# Altium project 油浴锅.PrjPcb
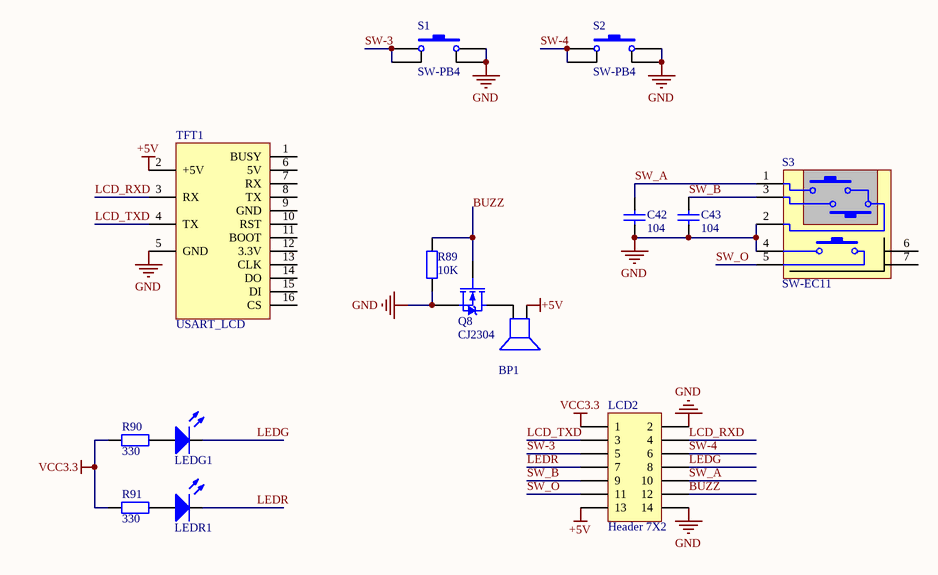
[diagram p0: 显示面板.SchDoc]
4 sheets, 243 parts. Net scope: global (net labels, ports and power ports of the same name join across sheets).
Board files: 显示面板.PcbDoc, 搅拌机主控.PcbDoc
Sheets:
  显示面板.SchDoc
  PT100检测电路.SchDoc
  MCU.SchDoc
  DC24V驱动.SchDoc

## Sheet 显示面板.SchDoc
size A4

### Parts
BP1  BUZZER  [蜂鸣器]  (value not drawn)
C42  value 104  [C-RAD-0603]  (hidden comment: Cap)
C43  value 104  [C-RAD-0603]  (hidden comment: Cap)
LCD2  Header 7X2  [HDR7X2_A1]
LEDG1  COLOUR  [LEDφ6]  (value not drawn)
LEDR1  COLOUR  [LEDφ6]  (value not drawn)
Q8  CJ2304  [SOT-23]
R89  value 10K  [0603-1]  (hidden comment: Res1)
R90  value 330  [0603-1]  (hidden comment: Res1)
R91  value 330  [0603-1]  (hidden comment: Res1)
S1  SW-PB4  [SW_PB4_A1]
S2  SW-PB4  [SW_PB4_A1]
S3  SW-EC11  [EC11]
TFT1  USART_LCD  [3.0寸]

### Nets
+5V: BP1.1(+) LCD2.13 TFT1.2(+5V)
GND: C42.1 C43.1 LCD2.2 LCD2.14 Q8.2(S) R89.1 S1.2 S1.3 S2.2 S2.3 S3.2 S3.4 TFT1.5(GND)
VCC3.3: LCD2.1 R90.2 R91.2
BUZZ: LCD2.12 Q8.1(G) R89.2
LCD_RXD: LCD2.4 TFT1.3(RX)
LCD_TXD: LCD2.3 TFT1.4(TX)
LEDG: LCD2.8 LEDG1.2(-)
LEDR: LCD2.7 LEDR1.2(-)
SW-3: LCD2.5 S1.1 S1.4
SW-4: LCD2.6 S2.1 S2.4
SW_A: C42.2 LCD2.10 S3.1
SW_B: C43.2 LCD2.9 S3.3
SW_O: LCD2.11 S3.5
NetBP1_2: BP1.2(-) Q8.3(D)
NetLEDG1_1: LEDG1.1(+) R90.1
NetLEDR1_1: LEDR1.1(+) R91.1

Not connected (* = marked no-connect by the designer): S3 6 7; TFT1 1(BUSY) 6(5V) 7(RX) 8(TX) 9(GND) 10(RST) 11(BOOT) 12(3.3V) 13(CLK) 14(DO) 15(DI) 16(CS)

### Library data of the parts
BP1 = BUZZER: 蜂鸣器
C42 C43 = Cap: 无极性电容; Published: 8-Jun-2000; LatestRevisionDate: 17-Jul-2002; LatestRevisionNote: Re-released for DXP Platform.; PackageReference: RAD-0.3; Publisher: Altium Limited
LCD2 = Header 7X2: Header, 7-Pin; LatestRevisionDate: 17-Jul-2002; LatestRevisionNote: Re-released for DXP Platform.; Publisher: Altium Limited
LEDG1 LEDR1 = ledφ6
Q8 = MOSFET-N: N-Channel MOSFET; PackageDocument: 1995/1996; Published: 8-Jun-2000; LatestRevisionDate: 17-Jul-2002; LatestRevisionNote: Re-released for DXP Platform.; PackageReference: E3; Publisher: Altium Limited
R89-R91 = Res1: 贴片电阻; Published: 8-Jun-2000; LatestRevisionDate: 17-Jul-2002; LatestRevisionNote: Re-released for DXP Platform.; PackageReference: AXIAL-0.4; Publisher: Altium Limited
S1 S2 = SW-PB4: 微动开关; Published: 24-Mar-1999; LatestRevisionDate: 17-Jul-2002; LatestRevisionNote: Re-released for DXP Platform.; PackageReference: SPST-2; Publisher: Altium Limited
S3 = SW-EC11: 旋转编码开关; Published: 24-Mar-1999; LatestRevisionDate: 17-Jul-2002; LatestRevisionNote: Re-released for DXP Platform.; PackageReference: SPST-2; Publisher: Altium Limited
TFT1 = USART_LCD: usart串口屏

## Sheet PT100检测电路.SchDoc
size A3
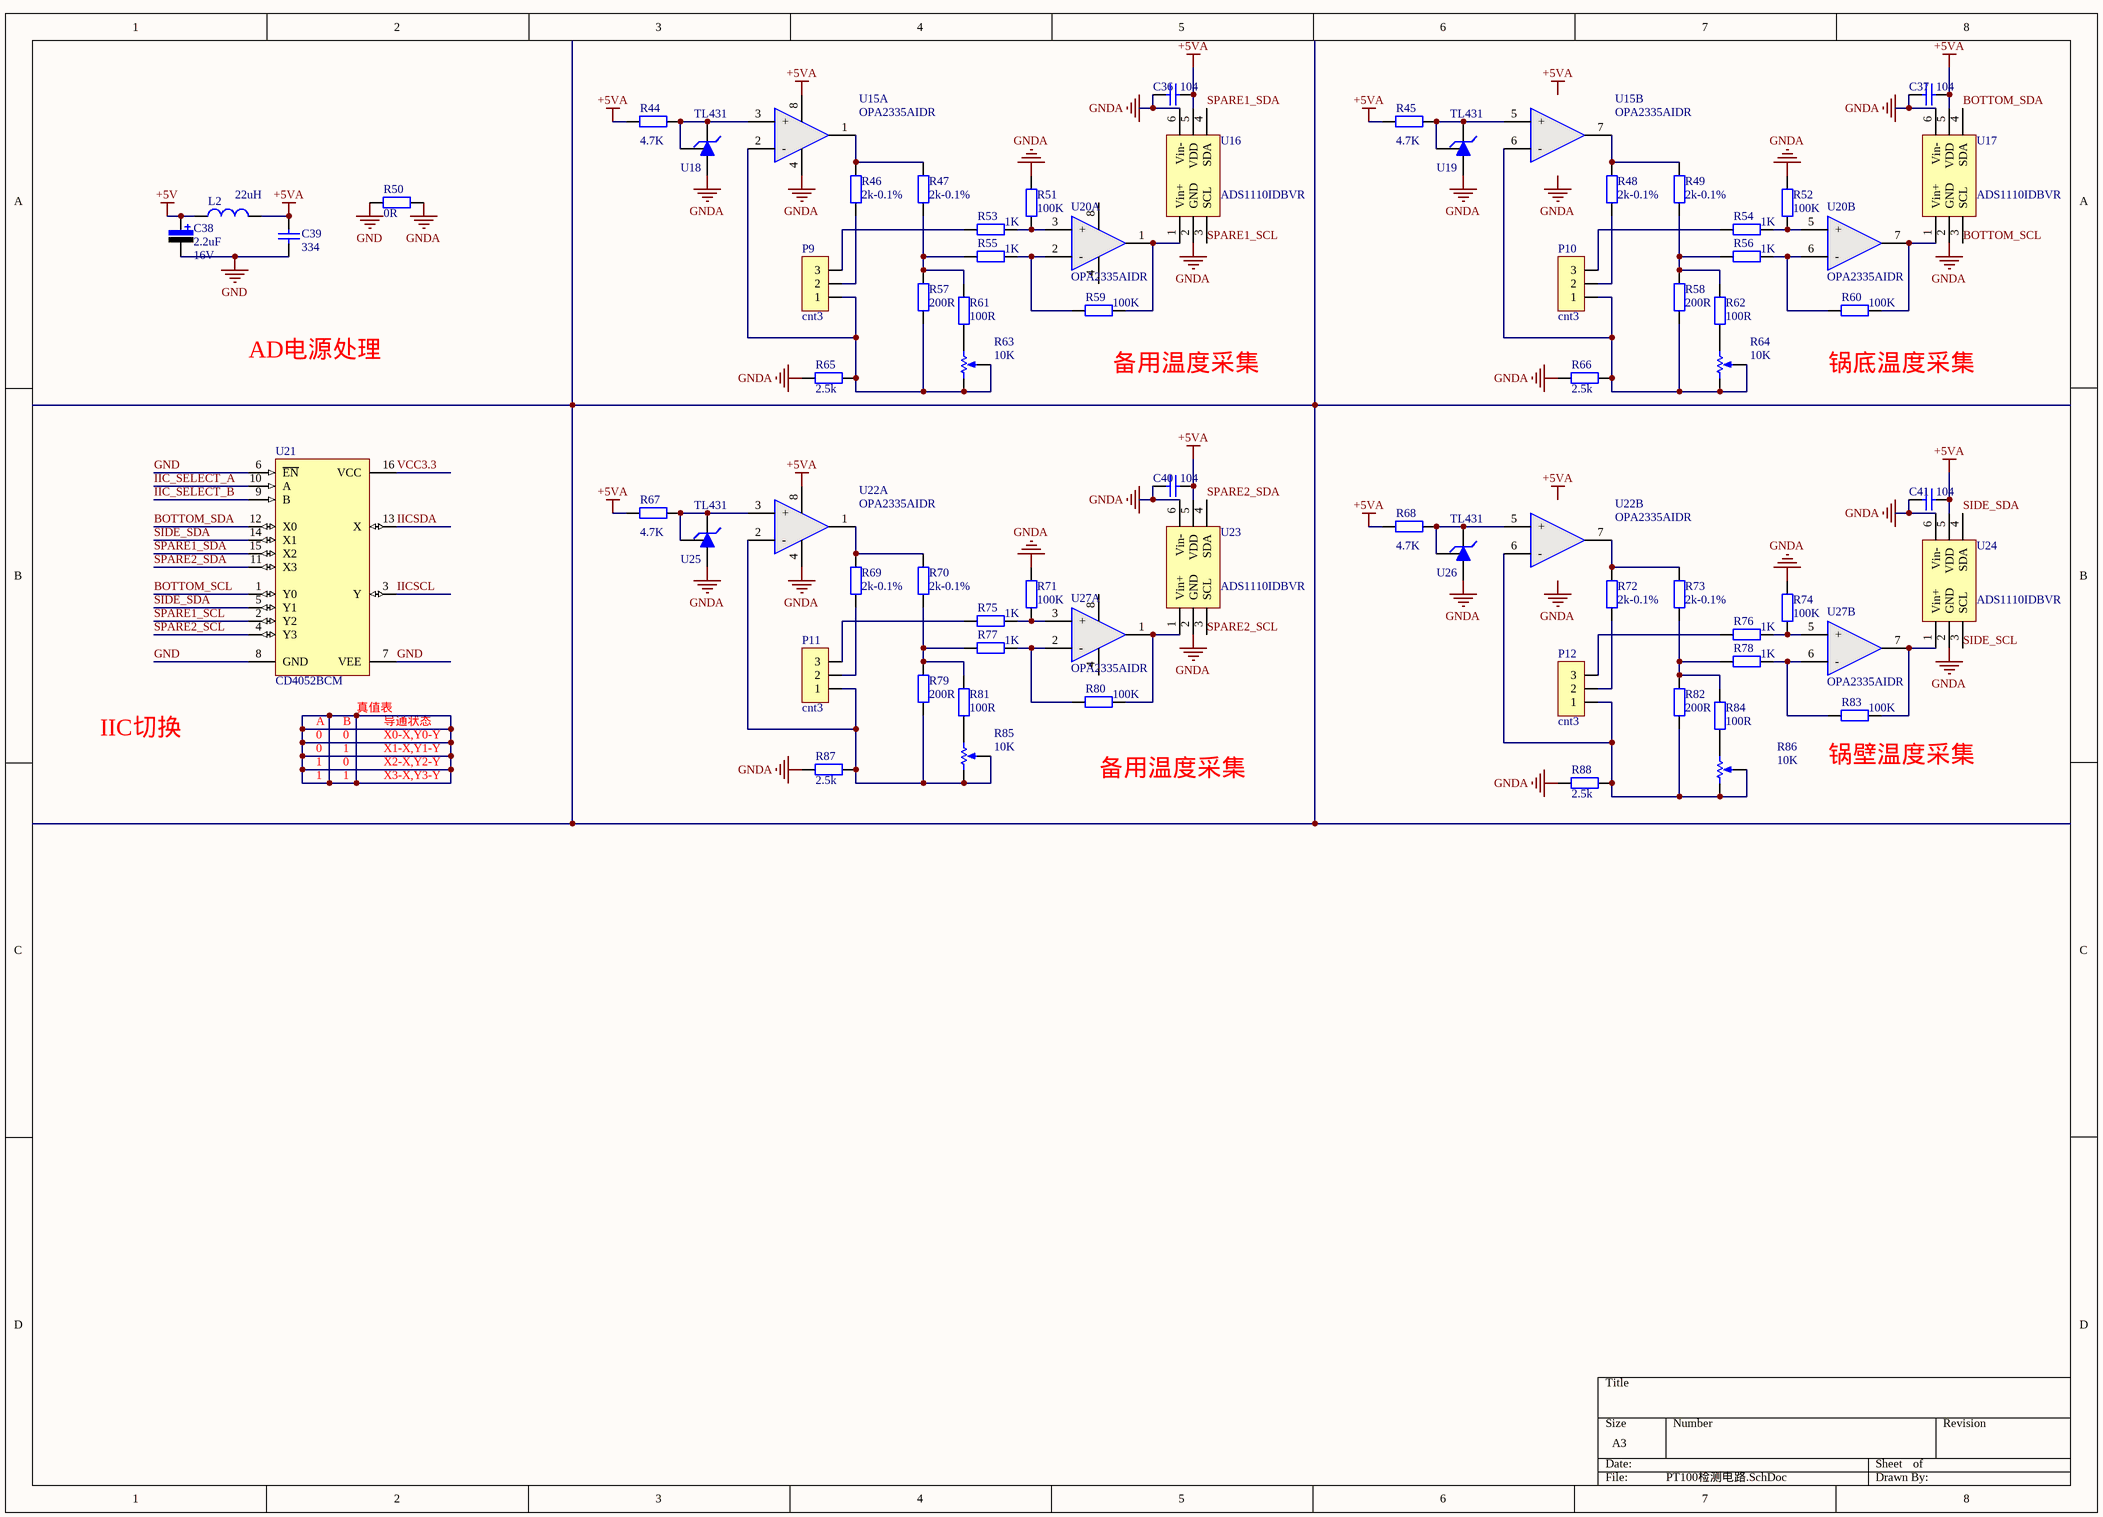
[diagram p1: PT100检测电路.SchDoc]

### Parts
C36  value 104  [C-RAD-0603]  (hidden comment: Cap)
C37  value 104  [C-RAD-0603]  (hidden comment: Cap)
C38  value 2.2uF  Vol: 16V  [CAP-3216]  (hidden comment: Cap Pol)
C39  value 334  [C-RAD-0603]  (hidden comment: Cap)
C40  value 104  [C-RAD-0603]  (hidden comment: Cap)
C41  value 104  [C-RAD-0603]  (hidden comment: Cap)
L2  value 22uH  [1206]  (hidden comment: Inductor)
P9  cnt3  [7.62mmPCB接线端子3p]
P10  cnt3  [7.62mmPCB接线端子3p]
P11  cnt3  [7.62mmPCB接线端子3p]
P12  cnt3  [7.62mmPCB接线端子3p]
R44  value 4.7K  [0603-1]  (hidden comment: Res1)
R45  value 4.7K  [0603-1]  (hidden comment: Res1)
R46  value 2k-0.1%  [0603-1]  (hidden comment: Res1)
R47  value 2k-0.1%  [0603-1]  (hidden comment: Res1)
R48  value 2k-0.1%  [0603-1]  (hidden comment: Res1)
R49  value 2k-0.1%  [0603-1]  (hidden comment: Res1)
R50  value 0R  [0603-1]  (hidden comment: Res1)
R51  value 100K  [0603-1]  (hidden comment: Res1)
R52  value 100K  [0603-1]  (hidden comment: Res1)
R53  value 1K  [0603-1]  (hidden comment: Res1)
R54  value 1K  [0603-1]  (hidden comment: Res1)
R55  value 1K  [0603-1]  (hidden comment: Res1)
R56  value 1K  [0603-1]  (hidden comment: Res1)
R57  value 200R  [0603-1]  (hidden comment: Res1)
R58  value 200R  [0603-1]  (hidden comment: Res1)
R59  value 100K  [0603-1]  (hidden comment: Res1)
R60  value 100K  [0603-1]  (hidden comment: Res1)
R61  value 100R  [0603-1]  (hidden comment: Res1)
R62  value 100R  [0603-1]  (hidden comment: Res1)
R63  value 10K  [VR-3266W]  (hidden comment: RPot)
R64  value 10K  [VR-3266W]  (hidden comment: RPot)
R65  value 2.5k  [0603-1]  (hidden comment: Res1)
R66  value 2.5k  [0603-1]  (hidden comment: Res1)
R67  value 4.7K  [0603-1]  (hidden comment: Res1)
R68  value 4.7K  [0603-1]  (hidden comment: Res1)
R69  value 2k-0.1%  [0603-1]  (hidden comment: Res1)
R70  value 2k-0.1%  [0603-1]  (hidden comment: Res1)
R71  value 100K  [0603-1]  (hidden comment: Res1)
R72  value 2k-0.1%  [0603-1]  (hidden comment: Res1)
R73  value 2k-0.1%  [0603-1]  (hidden comment: Res1)
R74  value 100K  [0603-1]  (hidden comment: Res1)
R75  value 1K  [0603-1]  (hidden comment: Res1)
R76  value 1K  [0603-1]  (hidden comment: Res1)
R77  value 1K  [0603-1]  (hidden comment: Res1)
R78  value 1K  [0603-1]  (hidden comment: Res1)
R79  value 200R  [0603-1]  (hidden comment: Res1)
R80  value 100K  [0603-1]  (hidden comment: Res1)
R81  value 100R  [0603-1]  (hidden comment: Res1)
R82  value 200R  [0603-1]  (hidden comment: Res1)
R83  value 100K  [0603-1]  (hidden comment: Res1)
R84  value 100R  [0603-1]  (hidden comment: Res1)
R85  value 10K  [VR-3266W]  (hidden comment: RPot)
R86  value 10K  [VR-3266W]  (hidden comment: RPot)
R87  value 2.5k  [0603-1]  (hidden comment: Res1)
R88  value 2.5k  [0603-1]  (hidden comment: Res1)
U15  OPA2335AIDR  [NSO8_N]  (parts A,B of 2)
U16  ADS1110IDBVR  [SOT23-6]
U17  ADS1110IDBVR  [SOT23-6]
U18  TL431  [SOT23]
U19  TL431  [SOT23]
U20  OPA2335AIDR  [NSO8_N]  (parts A,B of 2)
U21  CD4052BCM  [NSO16_M]
U22  OPA2335AIDR  [NSO8_N]  (parts A,B of 2)
U23  ADS1110IDBVR  [SOT23-6]
U24  ADS1110IDBVR  [SOT23-6]
U25  TL431  [SOT23]
U26  TL431  [SOT23]
U27  OPA2335AIDR  [NSO8_N]  (parts A,B of 2)

### Nets
+5V: C38.1 L2.1
+5VA: C36.2 C37.2 C39.1 C40.2 C41.2 L2.2 R44.1 R45.1 R67.1 R68.1 U15.8(V+) U16.5(VDD) U17.5(VDD) U22.8(V+) U23.5(VDD) U24.5(VDD)
GND: C38.2 C39.2 R50.2 U21.6(~{EN}) U21.7(VEE) U21.8(GND)
GNDA: C36.1 C37.1 C40.1 C41.1 R50.1 R51.2 R52.2 R65.1 R66.1 R71.2 R74.2 R87.1 R88.1 U15.4(V-) U16.2(GND) U16.6(Vin-) U17.2(GND) U17.6(Vin-) U18.3 U19.3 U22.4(V-) U23.2(GND) U23.6(Vin-) U24.2(GND) U24.6(Vin-) U25.3 U26.3
VCC3.3: U21.16(VCC)
BOTTOM_SCL: U17.3(SCL) U21.1(Y0)
BOTTOM_SDA: U17.4(SDA) U21.12(X0)
IIC_SELECT_A: U21.10(A)
IIC_SELECT_B: U21.9(B)
IICSCL: U21.3(Y)
IICSDA: U21.13(X)
SIDE_SCL: U24.3(SCL)
SIDE_SDA: U21.5(Y1) U21.14(X1) U24.4(SDA)
SPARE1_SCL: U16.3(SCL) U21.2(Y2)
SPARE1_SDA: U16.4(SDA) U21.15(X2)
SPARE2_SCL: U21.4(Y3) U23.3(SCL)
SPARE2_SDA: U21.11(X3) U23.4(SDA)
NetP9_1: P9.1 R57.1 R63.1(TOP) R63.2(TAP) R65.2 U15.2(-)
NetP9_2: P9.2 R46.1
NetP9_3: P9.3 R53.1
NetP10_1: P10.1 R58.1 R64.1(TOP) R64.2(TAP) R66.2 U15.6(-)
NetP10_2: P10.2 R48.1
NetP10_3: P10.3 R54.1
NetP11_1: P11.1 R79.1 R85.1(TOP) R85.2(TAP) R87.2 U22.2(-)
NetP11_2: P11.2 R69.1
NetP11_3: P11.3 R75.1
NetP12_1: P12.1 R82.1 R86.1(TOP) R86.2(TAP) R88.2 U22.6(-)
NetP12_2: P12.2 R72.1
NetP12_3: P12.3 R76.1
NetR44_2: R44.2 U15.3(+) U18.1 U18.2
NetR45_2: R45.2 U15.5(+) U19.1 U19.2
NetR46_2: R46.2 R47.2 U15.1(OUT1)
NetR47_1: R47.1 R55.1 R57.2 R61.2
NetR48_2: R48.2 R49.2 U15.7(OUT2)
NetR49_1: R49.1 R56.1 R58.2 R62.2
NetR51_1: R51.1 R53.2 U20.3(+)
NetR52_1: R52.1 R54.2 U20.5(+)
NetR55_2: R55.2 R59.1 U20.2(-)
NetR56_2: R56.2 R60.1 U20.6(-)
NetR59_2: R59.2 U16.1(Vin+) U20.1(OUT1)
NetR60_2: R60.2 U17.1(Vin+) U20.7(OUT2)
NetR61_1: R61.1 R63.3(BOT)
NetR62_1: R62.1 R64.3(BOT)
NetR67_2: R67.2 U22.3(+) U25.1 U25.2
NetR68_2: R68.2 U22.5(+) U26.1 U26.2
NetR69_2: R69.2 R70.2 U22.1(OUT1)
NetR70_1: R70.1 R77.1 R79.2 R81.2
NetR71_1: R71.1 R75.2 U27.3(+)
NetR72_2: R72.2 R73.2 U22.7(OUT2)
NetR73_1: R73.1 R78.1 R82.2 R84.2
NetR74_1: R74.1 R76.2 U27.5(+)
NetR77_2: R77.2 R80.1 U27.2(-)
NetR78_2: R78.2 R83.1 U27.6(-)
NetR80_2: R80.2 U23.1(Vin+) U27.1(OUT1)
NetR81_1: R81.1 R85.3(BOT)
NetR83_2: R83.2 U24.1(Vin+) U27.7(OUT2)
NetR84_1: R84.1 R86.3(BOT)

Not connected (* = marked no-connect by the designer): U20 4(V-) 8(V+); U27 4(V-) 8(V+)

### Notes on the sheet
- AD电源处理
- (near R59) 备用温度采集
- (near R60) 锅底温度采集
- A
- B
- (near U21) 真值表
- 导通状态
- IIC切换
- 0
- 1
- X0-X,Y0-Y
- X1-X,Y1-Y
- X2-X,Y2-Y
- X3-X,Y3-Y
- 备用温度采集
- (near R83) 锅壁温度采集
- Labels drawn without touching a wire or pin: +5VA, GNDA

### Library data of the parts
C36 C37 C39-C41 = Cap: 无极性电容; Published: 8-Jun-2000; LatestRevisionDate: 17-Jul-2002; LatestRevisionNote: Re-released for DXP Platform.; PackageReference: RAD-0.3; Publisher: Altium Limited
C38 = Cap Pol: 极性电解电容; Published: 8-Jun-2000; LatestRevisionDate: 17-Jul-2002; LatestRevisionNote: Re-released for DXP Platform.; PackageReference: RB7.6-15; Publisher: Altium Limited
L2 = Inductor: 电感; Code_IEC: 1005; Published: 8-Jun-2000; LatestRevisionDate: 17-Jul-2002; LatestRevisionNote: Re-released for DXP Platform.; PackageReference: 0402-A; Publisher: Altium Limited; Code_JEITA: 0402
P9-P12 = cnt3: 3p接线端子
R44-R62 R65-R84 R87 R88 = Res1: 贴片电阻; Published: 8-Jun-2000; LatestRevisionDate: 17-Jul-2002; LatestRevisionNote: Re-released for DXP Platform.; PackageReference: AXIAL-0.4; Publisher: Altium Limited
R63 R64 R85 R86 = RPot: 精密可调电阻; Sim Note: Enter the Resistance value and the set point into parameter fields.; Set Position: 0.5; Published: 8-Jun-2000; LatestRevisionDate: 17-Jul-2002; LatestRevisionNote: Re-released for DXP Platform.; PackageReference: VR5; Publisher: Altium Limited
U15 U20 U22 U27 = AD8667: 双运放
U16 U17 U23 U24 = ADS1110IDBVR: 16位内部基准AD芯片IIC
U21 = CD4052BCM: 双通道模拟开关; Published: 17-Jul-2002; LatestRevisionDate: 13-Apr-2006; LatestRevisionNote: IPC-7351 Footprint Added.; DatasheetVersion: Jan-1999; PackageVersion: 2000; PackageReference: M16A; Publisher: Altium Limited; PackageDescription: 16-Pin Small Outline Integrated Circuit 1.27 mm Pitch; Code_IPC: SOIC127P600-16; ComponentLink1Description: Manufacturer Link; ComponentLink1URL: http://www.fairchildsemi.com/; ComponentLink2Description: Datasheet; ComponentLink2URL: http://www.fairchildsemi.com/ds/CD%2FCD4052BC.pdf

## Sheet MCU.SchDoc
size A3
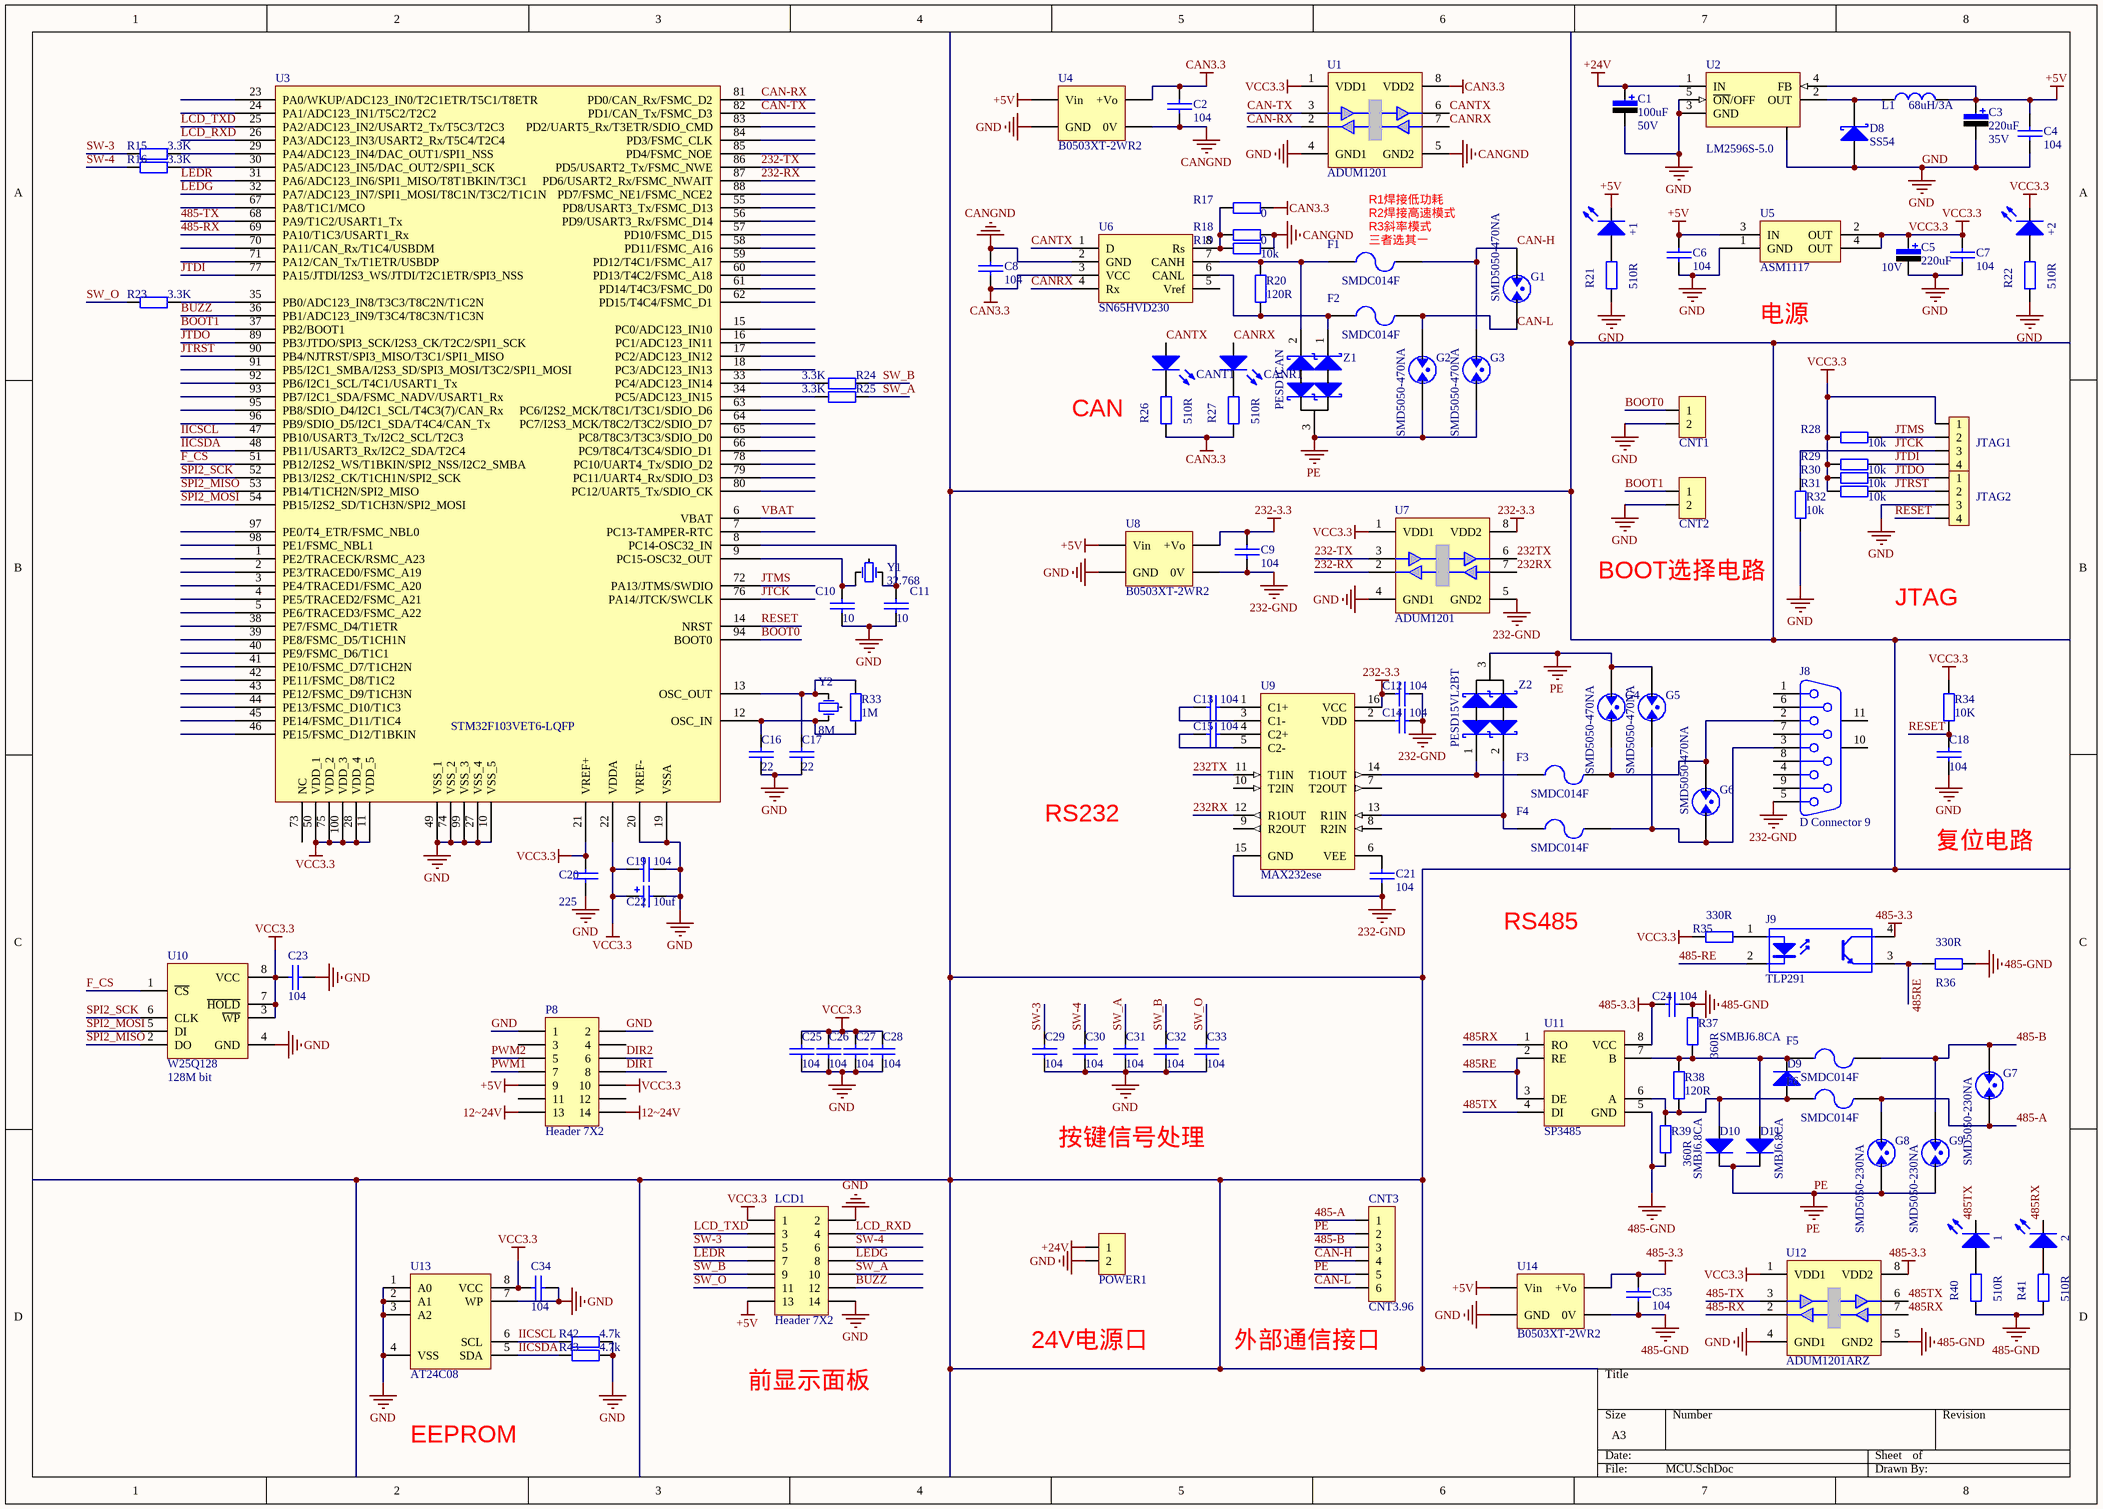
[diagram p2: MCU.SchDoc]

### Parts
1  COLOUR  [0603LED]  (value not drawn)
2  COLOUR  [0603LED]  (value not drawn)
+1  COLOUR  [0603LED]  (value not drawn)
+2  COLOUR  [0603LED]  (value not drawn)
C1  value 100uF  Vol: 50V  [C-RB-S10]  (hidden comment: Cap Pol)
C2  104  [0603C]
C3  value 220uF  Vol: 35V  [C-RB-S10]  (hidden comment: Cap Pol)
C4  104  [0603C]
C5  value 220uF  Vol: 10V  [CAP-7343]  (hidden comment: Cap Pol)
C6  104  [0603C]
C7  104  [0603C]
C8  104  [0603C]
C9  104  [0603C]
C10  10  [0603C]
C11  10  [0603C]
C12  104  [0603C]
C13  104  [0603C]
C14  104  [0603C]
C15  104  [0603C]
C16  22  [0603C]
C17  22  [0603C]
C18  104  [0603C]
C19  104  [0603C]
C20  225  [0603C]
C21  104  [0603C]
C22  10uf  [ct3216-18]
C23  104  [0603C]
C24  104  [0603C]
C25  104  [0603C]
C26  104  [0603C]
C27  104  [0603C]
C28  104  [0603C]
C29  104  [0603C]
C30  104  [0603C]
C31  104  [0603C]
C32  104  [0603C]
C33  104  [0603C]
C34  104  [0603C]
C35  104  [0603C]
CANR1  COLOUR  [0603LED]  (value not drawn)
CANT1  COLOUR  [0603LED]  (value not drawn)
CNT1  cnt2p  [cont-1]  (value not drawn)
CNT2  cnt2p  [cont-1]  (value not drawn)
CNT3  CNT3.96  [CNT3.96]
D8  Type: SS54  [DIODE-SMA]  (hidden comment: D-Schottky)
D9  Type: SMBJ6.8CA  [DIODE-SMB]  (hidden comment: TVS)
D10  Type: SMBJ6.8CA  [DIODE-SMB]  (hidden comment: TVS)
D11  Type: SMBJ6.8CA  [DIODE-SMB]  (hidden comment: TVS)
F1  SMDC014F  [1812]
F2  value SMDC014F  [1812]  (hidden comment: Fuse)
F3  SMDC014F  [1812]
F4  value SMDC014F  [1812]  (hidden comment: Fuse)
F5  SMDC014F  [1812]
F6  value SMDC014F  [1812]  (hidden comment: Fuse)
G1  SMD5050-470NA  [SMD5050]
G2  SMD5050-470NA  [SMD5050]
G3  SMD5050-470NA  [SMD5050]
G4  SMD5050-470NA  [SMD5050]
G5  SMD5050-470NA  [SMD5050]
G6  SMD5050-470NA  [SMD5050]
G7  SMD5050-230NA  [SMD5050]
G8  SMD5050-230NA  [SMD5050]
G9  SMD5050-230NA  [SMD5050]
J8  D Connector 9  [DB9-M]
J9  TLP291  [SOP127P710X350-4N]
JTAG1  单排插针11mm4p  [单排插针2.54]  (value not drawn)
JTAG2  单排插针11mm4p  [单排插针2.54]  (value not drawn)
L1  value 68uH/3A  [L-SMD-12]  (hidden comment: Inductor)
LCD1  Header 7X2  [HDR7X2_A1]
P8  Header 7X2  [HDR7X2_A1]
POWER1  CNT5.08MM*2 WAN  [CNT5.08*2WAN]  (value not drawn)
R15  value 3.3K  [0603-1]  (hidden comment: Res1)
R16  value 3.3K  [0603-1]  (hidden comment: Res1)
R17  value 0  [0603-1]  (hidden comment: Res1)
R18  value 0  [0603-1]  (hidden comment: Res1)
R19  value 10k  [0603-1]  (hidden comment: Res1)
R20  value 120R  [0603-1]  (hidden comment: Res1)
R21  value 510R  [0603-1]  (hidden comment: Res1)
R22  value 510R  [0603-1]  (hidden comment: Res1)
R23  value 3.3K  [0603-1]  (hidden comment: Res1)
R24  value 3.3K  [0603-1]  (hidden comment: Res1)
R25  value 3.3K  [0603-1]  (hidden comment: Res1)
R26  value 510R  [0603-1]  (hidden comment: Res1)
R27  value 510R  [0603-1]  (hidden comment: Res1)
R28  value 10k  [0603-1]  (hidden comment: Res1)
R29  value 10k  [0603-1]  (hidden comment: Res1)
R30  value 10k  [0603-1]  (hidden comment: Res1)
R31  value 10k  [0603-1]  (hidden comment: Res1)
R32  value 10k  [0603-1]  (hidden comment: Res1)
R33  value 1M  [0603-1]  (hidden comment: Res1)
R34  value 10K  [0603-1]  (hidden comment: Res1)
R35  value 330R  [0603-1]  (hidden comment: Res1)
R36  value 330R  [0603-1]  (hidden comment: Res1)
R37  value 360R  [0603-1]  (hidden comment: Res1)
R38  value 120R  [0603-1]  (hidden comment: Res1)
R39  value 360R  [0603-1]  (hidden comment: Res1)
R40  value 510R  [0603-1]  (hidden comment: Res1)
R41  value 510R  [0603-1]  (hidden comment: Res1)
R42  value 4.7k  [0603-1]  (hidden comment: Res1)
R43  value 4.7k  [0603-1]  (hidden comment: Res1)
U1  ADUM1201  [NSO8_N]
U2  LM2596S-5.0  [TO-263-5]
U3  STM32F103VET6-LQFP  [LQFP-100_M]
U4  B0503XT-2WR2  [B_XT-2WR2]
U5  ASM1117  [SOT-223]
U6  SN65HVD230  [NSO8_N]
U7  ADUM1201  [NSO8_N]
U8  B0503XT-2WR2  [B_XT-2WR2]
U9  MAX232ese  [NSO16_M]
U10  W25Q128  Memory: 128M bit  [SOIC8_W]
U11  SP3485  [NSO8_N]
U12  ADUM1201ARZ  [NSO8_N]
U13  AT24C08  [SOIC8_N]
U14  B0503XT-2WR2  [B_XT-2WR2]
Y1  value 32.768  [MC-146]  (hidden comment: XTAL_SM)
Y2  value 8M  [xtal3225]  (hidden comment: XTAL_SM)
Z1  PESD1CAN  [SOT-23]
Z2  PESD15VL2BT  [SOT-23]

### Nets
12~24V: P8.13 P8.14
232-3.3: C9.1 C12.2 U7.8(VDD2) U8.9(+Vo) U9.16(VCC)
232-GND: C9.2 C12.1 C14.1 C21.1 J8.5 U7.5(GND2) U8.8(0V) U9.15(GND)
485-3.3: C24.2 C35.1 J9.4(C) U11.8(VCC) U12.8(VDD2) U14.9(+Vo)
485-GND: C24.1 C35.2 R36.1 R37.2 R39.1 R40.1 R41.1 U11.5(GND) U12.5(GND2) U14.8(0V)
+5V: +1.2(-) C3.1 C4.1 C6.1 L1.2 LCD1.13 P8.9 U2.4(FB) U4.14(Vin) U5.3(IN) U8.14(Vin) U14.14(Vin)
+24V: C1.1 POWER1.1 U2.1(IN)
CAN3.3: C2.1 C8.2 R17.1 R26.1 R27.1 U1.8(VDD2) U4.9(+Vo) U6.3(VCC)
CANGND: C2.2 C8.1 R18.1 R19.1 U1.5(GND2) U4.8(0V) U6.2(GND)
GND: C1.2 C3.2 C4.2 C5.2 C6.2 C7.2 C10.2 C11.2 C16.2 C17.2 C18.1 C19.1 C20.1 C22.2 C23.1 C25.1 C26.1 C27.1 C28.1 C29.2 C30.2 C31.2 C32.2 C33.2 C34.1 CNT1.2 CNT2.2 D8.1(A) JTAG2.3 LCD1.2 LCD1.14 P8.1 P8.2 POWER1.2 R21.1 R22.1 R32.2 R42.1 R43.1 U1.4(GND1) U2.3(GND) U2.5(~{ON}/OFF) U2.6 U3.10(VSS_5) U3.19(VSSA) U3.20(VREF-) U3.27(VSS_4) U3.49(VSS_1) U3.74(VSS_2) U3.99(VSS_3) U4.1(GND) U5.1(GND) U7.4(GND1) U8.1(GND) U10.4(GND) U12.4(GND1) U13.1(A0) U13.2(A1) U13.3(A2) U13.4(VSS) U13.7(WP) U14.1(GND)
PE: CNT3.2 CNT3.5 D10.2(K) D11.2(K) G2.2 G3.2 G4.1 G5.1 G8.2 G9.2 Z1.3 Z2.3
VCC3.3: +2.2(-) C5.1 C7.1 C19.2 C20.2 C22.1 C23.2 C25.2 C26.2 C27.2 C28.2 C34.2 JTAG1.1 LCD1.1 P8.10 R28.2 R29.2 R30.2 R31.2 R34.2 R35.2 U1.1(VDD1) U3.11(VDD_5) U3.21(VREF+) U3.22(VDDA) U3.28(VDD_4) U3.50(VDD_1) U3.75(VDD_2) U3.100(VDD_3) U5.2(OUT) U5.4(OUT) U7.1(VDD1) U10.3(~{WP}) U10.7(~{HOLD}) U10.8(VCC) U12.1(VDD1) U13.8(VCC)
232-RX: U3.87(PD6/USART2_Rx/FSMC_NWAIT) U7.2(Voa)
232-TX: U3.86(PD5/USART2_Tx/FSMC_NWE) U7.3(Vib)
232RX: U7.7(Via) U9.12(R1OUT)
232TX: U7.6(Vob) U9.11(T1IN)
485-A: CNT3.1 F6.2 G7.2 G8.1
485-B: CNT3.3 F5.2 G7.1 G9.1
485-RE: J9.2(K)
485-RX: U3.69(PA10/T1C3/USART1_Rx) U12.2(Voa)
485-TX: U3.68(PA9/T1C2/USART1_Tx) U12.3(Vib)
485RE: J9.3(E) R36.2 U11.2(RE) U11.3(DE)
485RX: 2.2(-) U11.1(RO) U12.7(Via)
485TX: 1.2(-) U11.4(DI) U12.6(Vob)
BOOT0: CNT1.1 U3.94(BOOT0)
BOOT1: CNT2.1 U3.37(PB2/BOOT1)
BUZZ: LCD1.12 U3.36(PB1/ADC123_IN9/T3C4/T8C3N/T1C3N)
CAN-H: CNT3.4 F1.2 G1.1 G3.1
CAN-L: CNT3.6 F2.2 G1.2 G2.1
CAN-RX: U1.2(Voa) U3.81(PD0/CAN_Rx/FSMC_D2)
CAN-TX: U1.3(Vib) U3.82(PD1/CAN_Tx/FSMC_D3)
CANRX: CANR1.1(+) U1.7(Via) U6.4(Rx)
CANTX: CANT1.1(+) U1.6(Vob) U6.1(D)
DIR1: P8.8
DIR2: P8.6
F_CS: U3.51(PB12/I2S2_WS/T1BKIN/SPI2_NSS/I2C2_SMBA) U10.1(~{CS})
IICSCL: R42.2 U3.47(PB10/USART3_Tx/I2C2_SCL/T2C3) U13.6(SCL)
IICSDA: R43.2 U3.48(PB11/USART3_Rx/I2C2_SDA/T2C4) U13.5(SDA)
JTCK: JTAG1.3 R32.1 U3.76(PA14/JTCK/SWCLK)
JTDI: JTAG1.4 R29.1 U3.77(PA15/JTDI/I2S3_WS/JTDI/T2C1ETR/SPI3_NSS)
JTDO: JTAG2.1 R30.1 U3.89(PB3/JTDO/SPI3_SCK/I2S3_CK/T2C2/SPI1_SCK)
JTMS: JTAG1.2 R28.1 U3.72(PA13/JTMS/SWDIO)
JTRST: JTAG2.2 R31.1 U3.90(PB4/NJTRST/SPI3_MISO/T3C1/SPI1_MISO)
LCD_RXD: LCD1.4 U3.26(PA3/ADC123_IN3/USART2_Rx/T5C4/T2C4)
LCD_TXD: LCD1.3 U3.25(PA2/ADC123_IN2/USART2_Tx/T5C3/T2C3)
LEDG: LCD1.8 U3.32(PA7/ADC123_IN7/SPI1_MOSI/T8C1N/T3C2/T1C1N)
LEDR: LCD1.7 U3.31(PA6/ADC123_IN6/SPI1_MISO/T8T1BKIN/T3C1)
PWM1: P8.7
PWM2: P8.5
RESET: C18.2 JTAG2.4 R34.1 U3.14(NRST)
SPI2_MISO: U3.53(PB14/T1CH2N/SPI2_MISO) U10.2(DO)
SPI2_MOSI: U3.54(PB15/I2S2_SD/T1CH3N/SPI2_MOSI) U10.5(DI)
SPI2_SCK: U3.52(PB13/I2S2_CK/T1CH1N/SPI2_SCK) U10.6(CLK)
SW-3: C29.1 LCD1.5 R15.2
SW-4: C30.1 LCD1.6 R16.2
SW_A: C31.1 LCD1.10 R25.2
SW_B: C32.1 LCD1.9 R24.2
SW_O: C33.1 LCD1.11 R23.2
VBAT: U3.6(VBAT)
Net1_1: 1.1(+) R40.2
Net2_1: 2.1(+) R41.2
Net+1_1: +1.1(+) R21.2
Net+2_1: +2.1(+) R22.2
NetC10_1: C10.1 U3.9(PC15-OSC32_OUT) Y1.1(OSC1)
NetC11_1: C11.1 U3.8(PC14-OSC32_IN) Y1.2(OSC2)
NetC13_1: C13.1 U9.1(C1+)
NetC13_2: C13.2 U9.3(C1-)
NetC14_2: C14.2 U9.2(VDD)
NetC15_1: C15.1 U9.4(C2+)
NetC15_2: C15.2 U9.5(C2-)
NetC16_1: C16.1 R33.1 U3.12(OSC_IN) Y2.1(OSC1)
NetC17_1: C17.1 R33.2 U3.13(OSC_OUT) Y2.2(OSC2)
NetC21_2: C21.2 U9.6(VEE)
NetCANR1_2: CANR1.2(-) R27.2
NetCANT1_2: CANT1.2(-) R26.2
NetD8_2: D8.2(K) L1.1 U2.2(OUT)
NetD9_1: D9.1(A) D10.1(A) F6.1 R38.1 R39.2 U11.6(A)
NetD9_2: D9.2(K) D11.1(A) F5.1 R37.1 R38.2 U11.7(B)
NetF1_1: F1.1 R20.2 U6.7(CANH) Z1.2
NetF2_1: F2.1 R20.1 U6.6(CANL) Z1.1
NetF3_1: F3.1 U9.14(T1OUT) Z2.1
NetF3_2: F3.2 G4.2 G6.1 J8.2
NetF4_1: F4.1 U9.13(R1IN) Z2.2
NetF4_2: F4.2 G5.2 G6.2 J8.3
NetJ9_1: J9.1(A) R35.1
NetR15_1: R15.1 U3.29(PA4/ADC123_IN4/DAC_OUT1/SPI1_NSS)
NetR16_1: R16.1 U3.30(PA5/ADC123_IN5/DAC_OUT2/SPI1_SCK)
NetR17_2: R17.2 R18.2 R19.2 U6.8(Rs)
NetR23_1: R23.1 U3.35(PB0/ADC123_IN8/T3C3/T8C2N/T1C2N)
NetR24_1: R24.1 U3.33(PC4/ADC123_IN14)
NetR25_1: R25.1 U3.34(PC5/ADC123_IN15)

Not connected (* = marked no-connect by the designer): J8 1 4 6 7 8 9 10(MH1) 11(MH2); P8 3 4 11 12; U3 1(PE2/TRACECK/RSMC_A23) 2(PE3/TRACED0/FSMC_A19) 3(PE4/TRACED1/FSMC_A20) 4(PE5/TRACED2/FSMC_A21) 5(PE6/TRACED3/FSMC_A22) 7(PC13-TAMPER-RTC) 15(PC0/ADC123_IN10) 16(PC1/ADC123_IN11) 17(PC2/ADC123_IN12) 18(PC3/ADC123_IN13) 23(PA0/WKUP/ADC123_IN0/T2C1ETR/T5C1/T8ETR) 24(PA1/ADC123_IN1/T5C2/T2C2) 38(PE7/FSMC_D4/T1ETR) 39(PE8/FSMC_D5/T1CH1N) 40(PE9/FSMC_D6/T1C1) 41(PE10/FSMC_D7/T1CH2N) 42(PE11/FSMC_D8/T1C2) 43(PE12/FSMC_D9/T1CH3N) 44(PE13/FSMC_D10/T1C3) 45(PE14/FSMC_D11/T1C4) 46(PE15/FSMC_D12/T1BKIN) 55(PD8/USART3_Tx/FSMC_D13) 56(PD9/USART3_Rx/FSMC_D14) 57(PD10/FSMC_D15) 58(PD11/FSMC_A16) 59(PD12/T4C1/FSMC_A17) 60(PD13/T4C2/FSMC_A18) 61(PD14/T4C3/FSMC_D0) 62(PD15/T4C4/FSMC_D1) 63(PC6/I2S2_MCK/T8C1/T3C1/SDIO_D6) 64(PC7/I2S3_MCK/T8C2/T3C2/SDIO_D7) 65(PC8/T8C3/T3C3/SDIO_D0) 66(PC9/T8C4/T3C4/SDIO_D1) 67(PA8/T1C1/MCO) 70(PA11/CAN_Rx/T1C4/USBDM) 71(PA12/CAN_Tx/T1ETR/USBDP) 73(NC) 78(PC10/UART4_Tx/SDIO_D2) 79(PC11/UART4_Rx/SDIO_D3) 80(PC12/UART5_Tx/SDIO_CK) 83(PD2/UART5_Rx/T3ETR/SDIO_CMD) 84(PD3/FSMC_CLK) 85(PD4/FSMC_NOE) 88(PD7/FSMC_NE1/FSMC_NCE2) 91(PB5/I2C1_SMBA/I2S3_SD/SPI3_MOSI/T3C2/SPI1_MOSI) 92(PB6/I2C1_SCL/T4C1/USART1_Tx) 93(PB7/I2C1_SDA/FSMC_NADV/USART1_Rx) 95(PB8/SDIO_D4/I2C1_SCL/T4C3(7)/CAN_Rx) 96(PB9/SDIO_D5/I2C1_SDA/T4C4/CAN_Tx) 97(PE0/T4_ETR/FSMC_NBL0) 98(PE1/FSMC_NBL1); U6 5(Vref); U9 7(T2OUT) 8(R2IN) 9(R2OUT) 10(T2IN); Y1 3; Y2 3

### Notes on the sheet
- R1焊接低功耗
- R2焊接高速模式
- (near F1) R3斜率模式
- (near F1) 三者选其一
- 电源
- CAN
- BOOT选择电路
- JTAG
- RS232
- 复位电路
- RS485
- 按键信号处理
- 前显示面板
- 24V电源口
- 外部通信接口
- EEPROM

### Library data of the parts
1 2 +1 +2 CANR1 CANT1 = ledφ6
C1 C3 C5 = Cap Pol: 极性电解电容; Published: 8-Jun-2000; LatestRevisionDate: 17-Jul-2002; LatestRevisionNote: Re-released for DXP Platform.; PackageReference: RB7.6-15; Publisher: Altium Limited
C2 C4 C6-C21 C23-C35 = CAP X: 安规电容
C22 = CAP: 电解电容
CNT3 = CNT3.96: 接线端子(3.96MM)
D8 = D-Schottky: 肖特基二极管; Published: 8-Jun-2000; LatestRevisionDate: 17-Jul-2002; LatestRevisionNote: Re-released for DXP Platform.; PackageReference: SMB; Publisher: Altium Limited; Code_JEDEC: DO-214-AA
D9-D11 = TVS: TVS保护; Published: 8-Jun-2000; LatestRevisionDate: 17-Jul-2002; LatestRevisionNote: Re-released for DXP Platform.; PackageDocument: Sep-1996; PackageReference: SMC; Publisher: Altium Limited; Code_JEDEC: DO-214-AB
F1-F6 = Fuse 2: 保险丝; Published: 8-Jun-2000; LatestRevisionDate: 17-Jul-2002; LatestRevisionNote: Re-released for DXP Platform.; PackageReference: PIN-W2/E2.8; Publisher: Altium Limited
  F1 F3 F5: Value: SMDC014F
G1-G9 = SMD5050-230NA: 230V 气体放电管
J8 = D Connector 9: 串口; PackageDocument: O; Positions: 9; Gender: Receptacle; Published: 15-Jun-2001; LatestRevisionDate: 17-Jul-2002; LatestRevisionNote: Re-released for DXP Platform.; DatasheetDocument: 1-Sep-1999; PackageReference: 788750; Publisher: Altium Limited; Orientation: Right Angle
J9 = TLP281: 光耦; Published: 24-Mar-1999; LatestRevisionDate: 04-Mar-2005; LatestRevisionNote: Sch pins 3 & 4 Swapped.; DatasheetDocument: Nov-2003; PackageReference: DIP-4; Publisher: Altium Limited
L1 = Inductor: 电感; Code_IEC: 1005; Published: 8-Jun-2000; LatestRevisionDate: 17-Jul-2002; LatestRevisionNote: Re-released for DXP Platform.; PackageReference: 0402-A; Publisher: Altium Limited; Code_JEITA: 0402
LCD1 P8 = Header 7X2: Header, 7-Pin; LatestRevisionDate: 17-Jul-2002; LatestRevisionNote: Re-released for DXP Platform.; Publisher: Altium Limited
R15-R43 = Res1: 贴片电阻; Published: 8-Jun-2000; LatestRevisionDate: 17-Jul-2002; LatestRevisionNote: Re-released for DXP Platform.; PackageReference: AXIAL-0.4; Publisher: Altium Limited
U1 U7 U12 = ADUM1201: ADI隔离芯片
U2 = LM2596S-5.0: 5V稳压芯片; Note: Tab is connected to GND; Published: 15-Apr-2002; DatasheetVersion: Dec-1997; PackageReference: TS5B; Publisher: Altium Limited; PackageDescription: D2-PAK; 5 Leads; Body 14.4 (inc. leads) x 10.4 mm (LxW max); ComponentLink1Description: Manufacturer Link; ComponentLink1URL: http://www.national.com/; ComponentLink2Description: Datasheet; ComponentLink2URL: http://www.national.com/ds.cgi/LM/LM2596.pdf; ComponentLink3Description: URL Link1; ComponentLink3URL: http://www.national.com/pf/LM/LM2596.html
U3 = STM32F103V: STM32单片机100引脚
U4 U8 U14 = B0503D-2WR2: 5v-3.3v-2w隔离电源
U5 = ASM1117: 3.3V稳压芯片
U6 = SN65HVD230: CAN芯片
U9 = MAX232: +5V Powered, Multi-Channel RS-232 Driver/Receiver; Published: 16-Jan-2001; LatestRevisionDate: 13-Apr-2006; LatestRevisionNote: IPC-7351 Footprint Added.; PackageReference: NSO16; Publisher: Altium Limited; PackageDescription: 16-Pin Small Outline Integrated Circuit 1.27 mm Pitch; Code_JEDEC: MS-012-AC; Code_IPC: SOIC127P600-16; ComponentLink1Description: Manufacturer Link; ComponentLink1URL: http://www.maxim-ic.com/; ComponentLink2Description: Datasheet; ComponentLink2URL: http://pdfserv.maxim-ic.com/en/ds/MAX220-MAX249.pdf
U10 = W25QXX: SPI FLASH
U11 = SP3485: 485总线芯片
U13 = AT24C02: EEROM存储器
Y1 Y2 = XTAL_SM: 圆柱晶振; Published: 8-Jun-2000; LatestRevisionDate: 17-Jul-2002; LatestRevisionNote: Re-released for DXP Platform.; PackageReference: R38; Publisher: Altium Limited
Z1 Z2 = PESD1CAN: 过压保护

## Sheet DC24V驱动.SchDoc
size A4
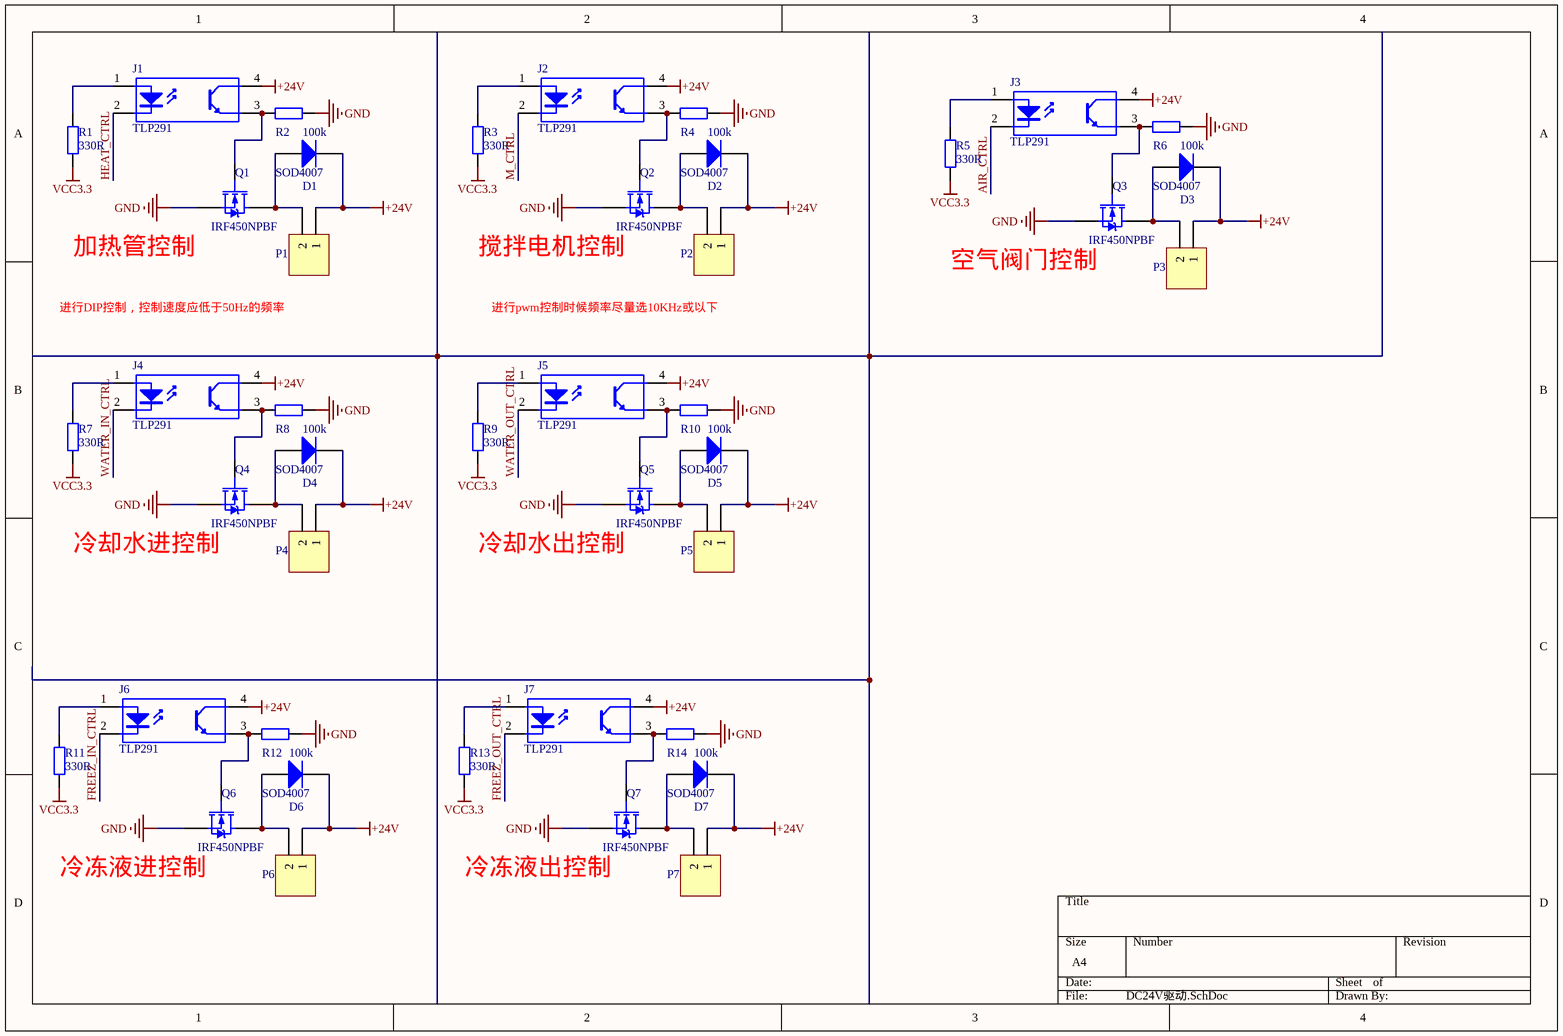
[diagram p3: DC24V驱动.SchDoc]

### Parts
D1  Type: SOD4007  [SOD123]  (hidden comment: Diode)
D2  Type: SOD4007  [SOD123]  (hidden comment: Diode)
D3  Type: SOD4007  [SOD123]  (hidden comment: Diode)
D4  Type: SOD4007  [SOD123]  (hidden comment: Diode)
D5  Type: SOD4007  [SOD123]  (hidden comment: Diode)
D6  Type: SOD4007  [SOD123]  (hidden comment: Diode)
D7  Type: SOD4007  [SOD123]  (hidden comment: Diode)
J1  TLP291  [SOP127P710X350-4N]
J2  TLP291  [SOP127P710X350-4N]
J3  TLP291  [SOP127P710X350-4N]
J4  TLP291  [SOP127P710X350-4N]
J5  TLP291  [SOP127P710X350-4N]
J6  TLP291  [SOP127P710X350-4N]
J7  TLP291  [SOP127P710X350-4N]
P1  Header 2  [HDR2X1_A]  (value not drawn)
P2  Header 2  [HDR2X1_A]  (value not drawn)
P3  Header 2  [HDR2X1_A]  (value not drawn)
P4  Header 2  [HDR2X1_A]  (value not drawn)
P5  Header 2  [HDR2X1_A]  (value not drawn)
P6  Header 2  [HDR2X1_A]  (value not drawn)
P7  Header 2  [HDR2X1_A]  (value not drawn)
Q1  IRF450NPBF  [TO-263-2]
Q2  IRF450NPBF  [TO-263-2]
Q3  IRF450NPBF  [TO-263-2]
Q4  IRF450NPBF  [TO-263-2]
Q5  IRF450NPBF  [TO-263-2]
Q6  IRF450NPBF  [TO-263-2]
Q7  IRF450NPBF  [TO-263-2]
R1  value 330R  [0603-1]  (hidden comment: Res1)
R2  value 100k  [0603-1]  (hidden comment: Res1)
R3  value 330R  [0603-1]  (hidden comment: Res1)
R4  value 100k  [0603-1]  (hidden comment: Res1)
R5  value 330R  [0603-1]  (hidden comment: Res1)
R6  value 100k  [0603-1]  (hidden comment: Res1)
R7  value 330R  [0603-1]  (hidden comment: Res1)
R8  value 100k  [0603-1]  (hidden comment: Res1)
R9  value 330R  [0603-1]  (hidden comment: Res1)
R10  value 100k  [0603-1]  (hidden comment: Res1)
R11  value 330R  [0603-1]  (hidden comment: Res1)
R12  value 100k  [0603-1]  (hidden comment: Res1)
R13  value 330R  [0603-1]  (hidden comment: Res1)
R14  value 100k  [0603-1]  (hidden comment: Res1)

### Nets
+24V: D1.2(K) D2.2(K) D3.2(K) D4.2(K) D5.2(K) D6.2(K) D7.2(K) J1.4(C) J2.4(C) J3.4(C) J4.4(C) J5.4(C) J6.4(C) J7.4(C) P1.1 P2.1 P3.1 P4.1 P5.1 P6.1 P7.1
GND: Q1.2(S) Q2.2(S) Q3.2(S) Q4.2(S) Q5.2(S) Q6.2(S) Q7.2(S) R2.1 R4.1 R6.1 R8.1 R10.1 R12.1 R14.1
VCC3.3: R1.2 R3.2 R5.2 R7.2 R9.2 R11.2 R13.2
AIR_CTRL: J3.2(K)
FREEZ_IN_CTRL: J6.2(K)
FREEZ_OUT_CTRL: J7.2(K)
HEAT_CTRL: J1.2(K)
M_CTRL: J2.2(K)
WATER_IN_CTRL: J4.2(K)
WATER_OUT_CTRL: J5.2(K)
NetD1_1: D1.1(A) P1.2 Q1.3(D)
NetD2_1: D2.1(A) P2.2 Q2.3(D)
NetD3_1: D3.1(A) P3.2 Q3.3(D)
NetD4_1: D4.1(A) P4.2 Q4.3(D)
NetD5_1: D5.1(A) P5.2 Q5.3(D)
NetD6_1: D6.1(A) P6.2 Q6.3(D)
NetD7_1: D7.1(A) P7.2 Q7.3(D)
NetJ1_1: J1.1(A) R1.1
NetJ1_3: J1.3(E) Q1.1(G) R2.2
NetJ2_1: J2.1(A) R3.1
NetJ2_3: J2.3(E) Q2.1(G) R4.2
NetJ3_1: J3.1(A) R5.1
NetJ3_3: J3.3(E) Q3.1(G) R6.2
NetJ4_1: J4.1(A) R7.1
NetJ4_3: J4.3(E) Q4.1(G) R8.2
NetJ5_1: J5.1(A) R9.1
NetJ5_3: J5.3(E) Q5.1(G) R10.2
NetJ6_1: J6.1(A) R11.1
NetJ6_3: J6.3(E) Q6.1(G) R12.2
NetJ7_1: J7.1(A) R13.1
NetJ7_3: J7.3(E) Q7.1(G) R14.2

### Notes on the sheet
- 进行DIP控制，控制速度应低于50Hz的频率
- 加热管控制
- 搅拌电机控制
- 进行pwm控制时候频率尽量选10KHz或以下
- 空气阀门控制
- 冷却水进控制
- 冷却水出控制
- 冷冻液进控制
- 冷冻液出控制

### Library data of the parts
D1-D7 = Diode: 二极管; Published: 8-Jun-2000; LatestRevisionDate: 17-Jul-2002; LatestRevisionNote: Re-released for DXP Platform.; PackageDocument: Sep-1996; PackageReference: SMC; Publisher: Altium Limited; Code_JEDEC: DO-214-AB
J1-J7 = TLP281: 光耦; Published: 24-Mar-1999; LatestRevisionDate: 04-Mar-2005; LatestRevisionNote: Sch pins 3 & 4 Swapped.; DatasheetDocument: Nov-2003; PackageReference: DIP-4; Publisher: Altium Limited
P1-P7 = Header 2: 接插件; LatestRevisionDate: 17-Jul-2002; LatestRevisionNote: Re-released for DXP Platform.; Publisher: Altium Limited
Q1-Q7 = MOSFET-N: as Q8 on sheet 显示面板; Published: 8-Jun-2000; LatestRevisionDate: 17-Jul-2002; LatestRevisionNote: Re-released for DXP Platform.; PackageReference: E3; Publisher: Altium Limited
R1-R14 = Res1: 贴片电阻; Published: 8-Jun-2000; LatestRevisionDate: 17-Jul-2002; LatestRevisionNote: Re-released for DXP Platform.; PackageReference: AXIAL-0.4; Publisher: Altium Limited

## Nets that join several sheets
+5V: 显示面板 (BP1.1 LCD2.13 TFT1.2), PT100检测电路 (C38.1 L2.1), MCU (12 pins)
+24V: MCU (C1.1 POWER1.1 U2.1), DC24V驱动 (21 pins)
GND: 显示面板 (13 pins), PT100检测电路 (6 pins), MCU (62 pins), DC24V驱动 (14 pins)
VCC3.3: 显示面板 (LCD2.1 R90.2 R91.2), PT100检测电路 (U21.16), MCU (37 pins), DC24V驱动 (7 pins)
BUZZ: 显示面板 (LCD2.12 Q8.1 R89.2), MCU (LCD1.12 U3.36)
IICSCL: PT100检测电路 (U21.3), MCU (R42.2 U3.47 U13.6)
IICSDA: PT100检测电路 (U21.13), MCU (R43.2 U3.48 U13.5)
LCD_RXD: 显示面板 (LCD2.4 TFT1.3), MCU (LCD1.4 U3.26)
LCD_TXD: 显示面板 (LCD2.3 TFT1.4), MCU (LCD1.3 U3.25)
LEDG: 显示面板 (LCD2.8 LEDG1.2), MCU (LCD1.8 U3.32)
LEDR: 显示面板 (LCD2.7 LEDR1.2), MCU (LCD1.7 U3.31)
SW-3: 显示面板 (LCD2.5 S1.1 S1.4), MCU (C29.1 LCD1.5 R15.2)
SW-4: 显示面板 (LCD2.6 S2.1 S2.4), MCU (C30.1 LCD1.6 R16.2)
SW_A: 显示面板 (C42.2 LCD2.10 S3.1), MCU (C31.1 LCD1.10 R25.2)
SW_B: 显示面板 (C43.2 LCD2.9 S3.3), MCU (C32.1 LCD1.9 R24.2)
SW_O: 显示面板 (LCD2.11 S3.5), MCU (C33.1 LCD1.11 R23.2)